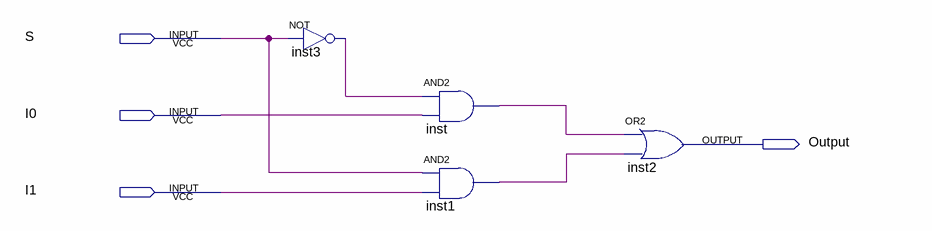
[diagram p0: schematic sheet]
// Quartus schematic Mux_2_1_Demo.bdf as structural Verilog: 4 symbols, 4 pins
module Mux_2_1_Demo (
  input  S,
  input  I0,
  input  I1,
  output Output
);

  wire inst1_out, inst3_out, inst_out;

  not inst3 (inst3_out, S);
  and inst (inst_out, inst3_out, I0);
  and inst1 (inst1_out, S, I1);
  or inst2 (Output, inst_out, inst1_out);
endmodule
